# Altium schematic sheet Ports.SchDoc
size A4
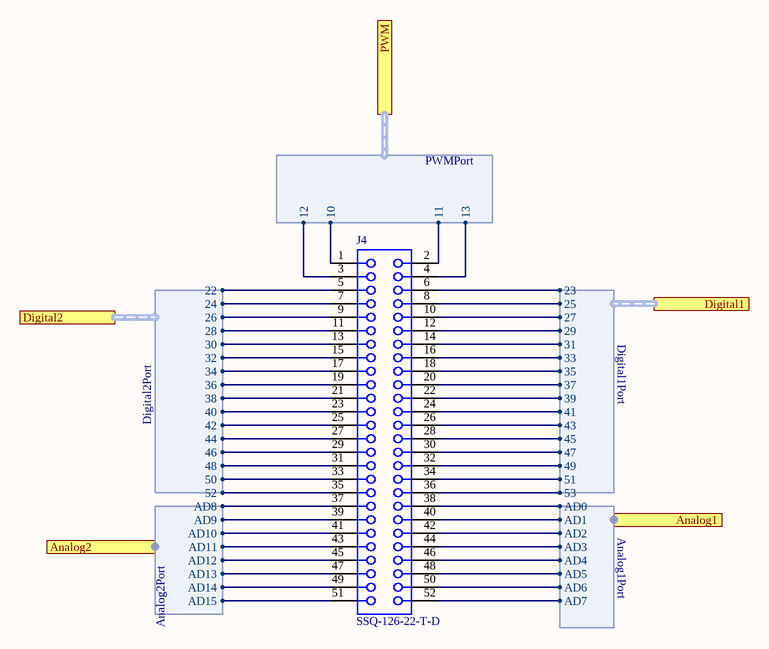
[diagram p0: Ports.SchDoc]

## Parts
J4  SSQ-126-22-T-D  [SMTC-SSQ-126-22-X-D]

## Ports
Analog1 (harness Analog1Port), Analog2 (harness Analog2Port), Digital1 (harness Digital1Port), Digital2 (harness Digital2Port), PWM (harness PWMPort)

## Harnesses
Digital2Port: 22, 24, 26, 28, 30, 32, 34, 36, 38, 40, 42, 44, 46, 48, 50, 52
Digital1Port: 23, 25, 27, 29, 31, 33, 35, 37, 39, 41, 43, 45, 47, 49, 51, 53
PWMPort: 10, 11, 12, 13
Analog1Port: AD0, AD1, AD2, AD3, AD4, AD5, AD6, AD7
Analog2Port: AD8, AD9, AD10, AD11, AD12, AD13, AD14, AD15

## Nets
NetJ4_1: J4.1 ; port PWM.10
NetJ4_2: J4.2 ; port PWM.11
NetJ4_3: J4.3 ; port PWM.12
NetJ4_4: J4.4 ; port PWM.13
NetJ4_5: J4.5 ; port Digital2.22
NetJ4_6: J4.6 ; port Digital1.23
NetJ4_7: J4.7 ; port Digital2.24
NetJ4_8: J4.8 ; port Digital1.25
NetJ4_9: J4.9 ; port Digital2.26
NetJ4_10: J4.10 ; port Digital1.27
NetJ4_11: J4.11 ; port Digital2.28
NetJ4_12: J4.12 ; port Digital1.29
NetJ4_13: J4.13 ; port Digital2.30
NetJ4_14: J4.14 ; port Digital1.31
NetJ4_15: J4.15 ; port Digital2.32
NetJ4_16: J4.16 ; port Digital1.33
NetJ4_17: J4.17 ; port Digital2.34
NetJ4_18: J4.18 ; port Digital1.35
NetJ4_19: J4.19 ; port Digital2.36
NetJ4_20: J4.20 ; port Digital1.37
NetJ4_21: J4.21 ; port Digital2.38
NetJ4_22: J4.22 ; port Digital1.39
NetJ4_23: J4.23 ; port Digital2.40
NetJ4_24: J4.24 ; port Digital1.41
NetJ4_25: J4.25 ; port Digital2.42
NetJ4_26: J4.26 ; port Digital1.43
NetJ4_27: J4.27 ; port Digital2.44
NetJ4_28: J4.28 ; port Digital1.45
NetJ4_29: J4.29 ; port Digital2.46
NetJ4_30: J4.30 ; port Digital1.47
NetJ4_31: J4.31 ; port Digital2.48
NetJ4_32: J4.32 ; port Digital1.49
NetJ4_33: J4.33 ; port Digital2.50
NetJ4_34: J4.34 ; port Digital1.51
NetJ4_35: J4.35 ; port Digital2.52
NetJ4_36: J4.36 ; port Digital1.53
NetJ4_37: J4.37 ; port Analog2.AD8
NetJ4_38: J4.38 ; port Analog1.AD0
NetJ4_39: J4.39 ; port Analog2.AD9
NetJ4_40: J4.40 ; port Analog1.AD1
NetJ4_41: J4.41 ; port Analog2.AD10
NetJ4_42: J4.42 ; port Analog1.AD2
NetJ4_43: J4.43 ; port Analog2.AD11
NetJ4_44: J4.44 ; port Analog1.AD3
NetJ4_45: J4.45 ; port Analog2.AD12
NetJ4_46: J4.46 ; port Analog1.AD4
NetJ4_47: J4.47 ; port Analog2.AD13
NetJ4_48: J4.48 ; port Analog1.AD5
NetJ4_49: J4.49 ; port Analog2.AD14
NetJ4_50: J4.50 ; port Analog1.AD6
NetJ4_51: J4.51 ; port Analog2.AD15
NetJ4_52: J4.52 ; port Analog1.AD7

## Library data of the parts
J4 = CMP-1023-00318-1: SQ Post Socket, Through-hole, Vertical, -55 to 105 degC, 2.54 mm Pitch, 52-Pin, Female, RoHS; Manufacturer: Samtec; Pitch: 2.54 mm; ComponentLink1Description: Manufacturer URL; PartNumber: SSQ-126-22-T-D; PackageDescription: Assembly, Socket Strip .025[0.64] SQ Tail; ComponentLink3Description: Package Specification; DatasheetVersion: F-214; ComponentLink2Description: Datasheet; PackageReference: SSQ-126-22-X-D; PackageVersion: BD, 6/1987; ComponentLink1URL: http://www.samtec.com; Mounting Technology: Through-hole; Orientation: Vertical; ComponentLink3URL: http://www.samtec.com/documents/webfiles/cpdf/SSQ-1XX-XX-XXX-X-XX-XXX-XX-X-MKT.pdf; Temperature Range: -55 to 105 degC; ComponentLink2URL: http://www.samtec.com/documents/webfiles/pdf/SSQ_TH.PDF; RoHS: True